# EAGLE schematic Transmitter-Bug-BC547 (EAGLE 7.7.0)
Simple FM Transmitter with Electret Microphone, based on NPN Transistor
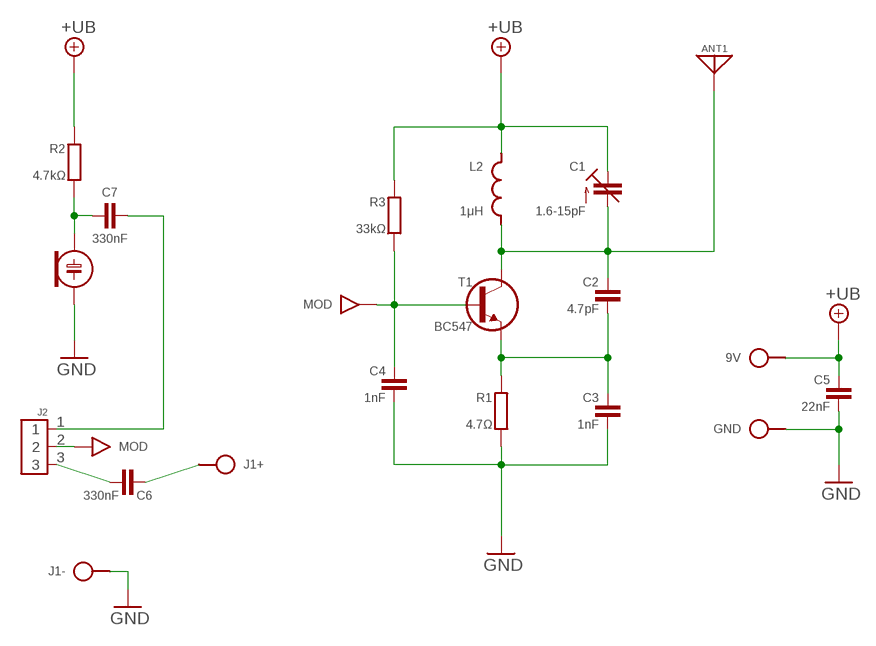
[diagram p0: schematic, sheet 1]

## Parts
9V  SPAD  [SPAD]
ANT1  ANT  [SPAD]
C1  1.6-15pF  C-TR-PH201272222-808-2PINB  [TRIM-2222-808]
C2  4.7pF  C025-015X024  [C025-015X024]
C3  1nF  C025-015X024  [C025-015X024]
C4  1nF  C050-020X036/V  [C050-020X036/V]
C5  22nF  C050-020X036/V  [C050-020X036/V]
C6  330nF  C-H050-020X044  [C050-020X044]
C7  330nF  C050-020X044  [C050-020X044]
ECM  ECM-4  [ECM-4]
GND  SPAD  [SPAD]
J1  SPAD+--+  [SPAD-+]
J2  CONN-3P-3P  [CONN-3P]
L2  1μH  L-SHORT04/7V-X  [L-04/7V-X]
R1  4.7Ω  R0204/2V  [0204/2V]
R2  4.7kΩ  R0202/7-V  [0202/7-V]
R3  33kΩ  R0202/7-V  [0202/7-V]
T1  BC547  BC547CBE  [TO92-CBE]

## Nets
+UB: 9V.1 C1.3(E) C5.1 L2.2 R2.1 R3.1
GND: C3.2 C4.2 C5.2 ECM.2(-) GND.1 J1.1 R1.2
MOD: C4.1 J2.2 R3.2 T1.B
N$1: C6.2 J2.3
N$2: ANT1.1 C1.2(A) C2.1 L2.1 T1.C
N$3: C2.2 C3.1 R1.1 T1.E
N$4: C7.2 J2.1
N$5: C6.1 J1.2
N$6: C7.1 ECM.1(+) R2.2

## Library data of the parts
9V GND = pad:SPAD
ANT1 = pad:ANT
C1 = cap-trim:C-TR-PH20127
C2-C5 C7 = c:C: CAPACITOR, European symbol
C6 = c:C-H
ECM = ECM:ECM
J1 = pad:SPAD+-
J2 = pinconn:CONN-3P
L2 = l:L-SHORT
R1-R3 = r:R: RESISTOR, European symbol
T1 = t:BC547

## Net classes
0 default: width 0.61 mm